# EAGLE design PANS (EAGLE 9.6.2)
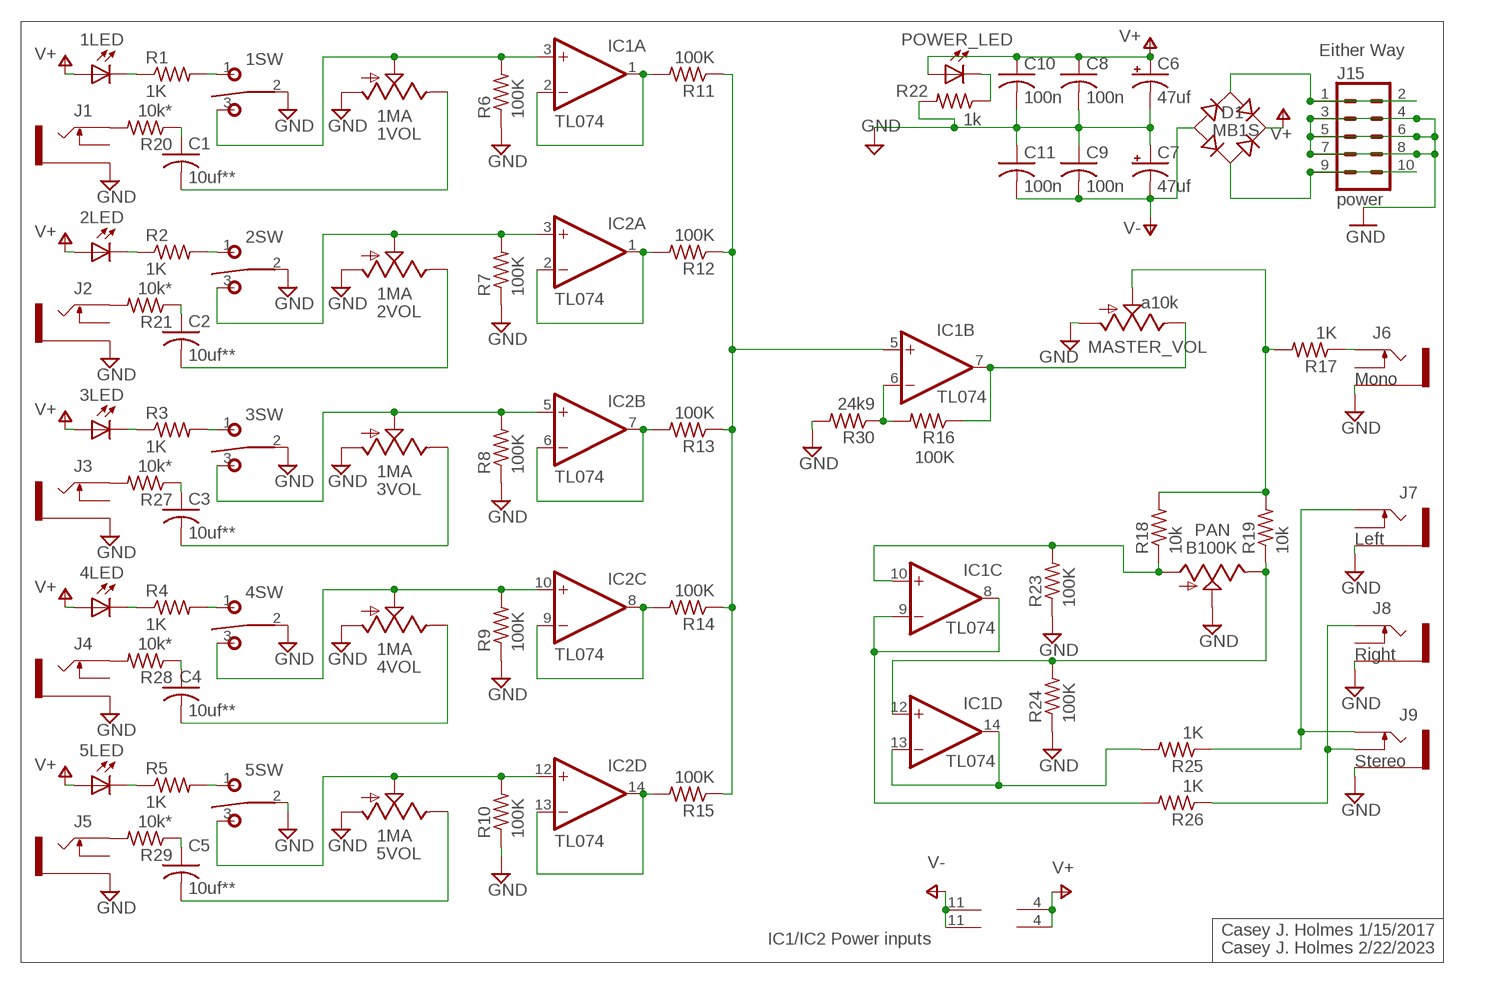
[diagram p0: schematic, sheet 1]

## Parts
1LED  green  LED5MM  [LED5MM]
1SW  on/on  T-80-T-SPDT-ON-OFF-ON  [M9040P]
1VOL  1MA  9MM_SNAP-IN_POT_  [9MM_SNAP-IN_POT]
2LED  green  LED5MM  [LED5MM]
2SW  on/on  T-80-T-SPDT-ON-OFF-ON  [M9040P]
2VOL  1MA  9MM_SNAP-IN_POT_  [9MM_SNAP-IN_POT]
3LED  green  LED5MM  [LED5MM]
3SW  on/on  T-80-T-SPDT-ON-OFF-ON  [M9040P]
3VOL  1MA  9MM_SNAP-IN_POT_  [9MM_SNAP-IN_POT]
4LED  green  LED5MM  [LED5MM]
4SW  on/on  T-80-T-SPDT-ON-OFF-ON  [M9040P]
4VOL  1MA  9MM_SNAP-IN_POT_  [9MM_SNAP-IN_POT]
5LED  green  LED5MM  [LED5MM]
5SW  on/on  T-80-T-SPDT-ON-OFF-ON  [M9040P]
5VOL  1MA  9MM_SNAP-IN_POT_  [9MM_SNAP-IN_POT]
C1  10uf**  C-USC0805K  [C0805K]
C2  10uf**  C-USC0805K  [C0805K]
C3  10uf**  C-USC0805K  [C0805K]
C4  10uf**  C-USC0805K  [C0805K]
C5  10uf**  C-USC0805K  [C0805K]
C6  47uf  CPOL-USD  [PANASONIC_D]
C7  47uf  CPOL-USD  [PANASONIC_D]
C8  100n  C-USC0805  [C0805]
C9  100n  C-USC0805  [C0805]
C10  100n  C-USC0805  [C0805]
C11  100n  C-USC0805  [C0805]
D1  MB1S  [SOIC-4]
IC1  TL074  TL074_SMD  [SO14]
IC2  TL074  TL074_SMD  [SO14]
J1  THONKICONNNEW  [WQP-PJ301M-12_JACK]
J2  THONKICONNNEW  [WQP-PJ301M-12_JACK]
J3  THONKICONNNEW  [WQP-PJ301M-12_JACK]
J4  THONKICONNNEW  [WQP-PJ301M-12_JACK]
J5  THONKICONNNEW  [WQP-PJ301M-12_JACK]
J6  THONKICONNNEW  [WQP-PJ301M-12_JACK]
J7  LEFT  THONKICONNNEW  [WQP-PJ301M-12_JACK]
J8  THONKICONNNEW  [WQP-PJ301M-12_JACK]
J9  Stereo  THONKICONNNEW  [WQP-PJ301M-12_JACK]
J15  power  CONN_05X2PTH  [2X5]
MASTER_VOL  a10k  9MM_SNAP-IN_POT_  [9MM_SNAP-IN_POT]
PAN  B100K  9MM_SNAP-IN_POT_  [9MM_SNAP-IN_POT]
POWER_LED  green  LED5MM  [LED5MM]
R1  1K  R-US_M0805  [M0805]
R2  1K  R-US_M0805  [M0805]
R3  1K  R-US_M0805  [M0805]
R4  1K  R-US_M0805  [M0805]
R5  1K  R-US_M0805  [M0805]
R6  100K  R-US_M0805  [M0805]
R7  100K  R-US_M0805  [M0805]
R8  100K  R-US_M0805  [M0805]
R9  100K  R-US_M0805  [M0805]
R10  100K  R-US_M0805  [M0805]
R11  100K  R-US_M0805  [M0805]
R12  100K  R-US_M0805  [M0805]
R13  100K  R-US_M0805  [M0805]
R14  100K  R-US_M0805  [M0805]
R15  100K  R-US_M0805  [M0805]
R16  100K  R-US_M0805  [M0805]
R17  1K  R-US_M0805  [M0805]
R18  10k  R-US_M0805  [M0805]
R19  10k  R-US_M0805  [M0805]
R20  10k*  R-US_M0805  [M0805]
R21  10k*  R-US_M0805  [M0805]
R22  1k  R-US_M0805  [M0805]
R23  100K  R-US_M0805  [M0805]
R24  100K  R-US_M0805  [M0805]
R25  1K  R-US_M0805  [M0805]
R26  1K  R-US_M0805  [M0805]
R27  10k*  R-US_M0805  [M0805]
R28  10k*  R-US_M0805  [M0805]
R29  10k*  R-US_M0805  [M0805]
R30  24k9  R-US_M0805  [M0805]

## Nets
C2: J2.P$1_TIP(TIP) R21.2
GND: 1SW.2(P) 1VOL.1(A) 2SW.2(P) 2VOL.1(A) 3SW.2(P) 3VOL.1(A) 4SW.2(P) 4VOL.1(A) 5SW.2(P) 5VOL.1(A) C6.- C7.+ C8.2 C9.1 C10.2 C11.1 J1.P$3_SLEEVE(SLEEVE) J2.P$3_SLEEVE(SLEEVE) J3.P$3_SLEEVE(SLEEVE) J4.P$3_SLEEVE(SLEEVE) J5.P$3_SLEEVE(SLEEVE) J6.P$3_SLEEVE(SLEEVE) J7.P$3_SLEEVE(SLEEVE) J8.P$3_SLEEVE(SLEEVE) J9.P$3_SLEEVE(SLEEVE) J15.3 J15.4 J15.5 J15.6 J15.7 J15.8 MASTER_VOL.1(A) PAN.2(S) R6.1 R7.1 R8.1 R9.1 R10.1 R22.2 R23.1 R24.1 R30.2
IC1: IC1.1(A:OUT) IC1.2(A:-IN) R11.2
N$1: J7.P$1_TIP(TIP) J9.P$1_TIP(TIP) R25.1
N$2: J1.P$1_TIP(TIP) R20.2
N$3: 1SW.1(O) R1.2
N$4: 1LED.K(C) R1.1
N$5: 1VOL.3(E) C1.2
N$6: 2SW.1(O) R2.2
N$7: 2LED.K(C) R2.1
N$8: 4LED.K(C) R4.1
N$9: 1SW.3(S) 1VOL.2(S) IC1.3(A:+IN) R6.2
N$10: 5LED.K(C) R5.1
N$11: 3LED.K(C) R3.1
N$12: 5SW.1(O) R5.2
N$13: J4.P$1_TIP(TIP) R28.2
N$14: 3SW.1(O) R3.2
N$15: 4SW.1(O) R4.2
N$16: J5.P$1_TIP(TIP) R29.2
N$17: IC1.6(B:-IN) R16.2 R30.1
N$18: 2VOL.3(E) C2.2
N$19: 3VOL.3(E) C3.2
N$20: 4VOL.3(E) C4.2
N$21: 5VOL.3(E) C5.2
N$22: 2SW.3(S) 2VOL.2(S) IC2.3(A:+IN) R7.2
N$23: 3SW.3(S) 3VOL.2(S) IC2.5(B:+IN) R8.2
N$24: 4SW.3(S) 4VOL.2(S) IC2.10(C:+IN) R9.2
N$25: 5SW.3(S) 5VOL.2(S) IC2.12(D:+IN) R10.2
N$26: J8.P$1_TIP(TIP) J9.P$2_SWITCH(SWITCH) R26.1
N$27: IC2.1(A:OUT) IC2.2(A:-IN) R12.2
N$28: IC2.6(B:-IN) IC2.7(B:OUT) R13.2
N$29: IC2.8(C:OUT) IC2.9(C:-IN) R14.2
N$30: IC2.13(D:-IN) IC2.14(D:OUT) R15.2
N$31: IC1.5(B:+IN) R11.1 R12.1 R13.1 R14.1 R15.1
N$32: POWER_LED.K(C) R22.1
N$33: MASTER_VOL.2(S) R17.2 R18.2 R19.2
N$34: J6.P$1_TIP(TIP) R17.1
N$35: C1.1 R20.1
N$36: IC1.12(D:+IN) PAN.3(E) R19.1 R24.2
N$37: C4.1 R28.1
N$38: IC1.10(C:+IN) PAN.1(A) R18.1 R23.2
N$39: IC1.8(C:OUT) IC1.9(C:-IN) R26.2
N$40: IC1.13(D:-IN) IC1.14(D:OUT) R25.2
N$41: IC1.7(B:OUT) MASTER_VOL.3(E) R16.1
N$42: C5.1 R29.1
N$43: C2.1 R21.1
N$44: C3.1 R27.1
N$45: J3.P$1_TIP(TIP) R27.2
N$47: D1.~2(AC2) J15.9 J15.10
SV1: D1.~1(AC1) J15.1 J15.2
V+: 1LED.A 2LED.A 3LED.A 4LED.A 5LED.A C6.+ C8.1 C10.1 D1.+ IC1.4(P:V+) IC2.4(P:V+) POWER_LED.A
V-: C7.- C9.2 C11.2 D1.- IC1.11(P:V-) IC2.11(P:V-)
Unconnected: J1.P$2_SWITCH(SWITCH) J2.P$2_SWITCH(SWITCH) J3.P$2_SWITCH(SWITCH) J4.P$2_SWITCH(SWITCH) J5.P$2_SWITCH(SWITCH) J6.P$2_SWITCH(SWITCH) J7.P$2_SWITCH(SWITCH) J8.P$2_SWITCH(SWITCH)

## Notes on the sheet
- Either Way
- Mono
- Left
- Right
- Stereo
- Casey J. Holmes 1/15/2017
- IC1/IC2 Power inputs
- Casey J. Holmes 2/22/2023

## Library data of the parts
1LED 2LED 3LED 4LED 5LED POWER_LED = adafruit:LED: LED OSRAM: - CHIPLED LG R971, LG N971, LY N971, LG Q971, LY Q971, LO R971, LY R971 LH N974, LH R974 LS Q976, LO Q976, LY Q976 LO Q996 - Hyper CHIPLED LW Q18S LB Q993, LB Q99A, LB R99A - SideLED LS A670, LO A670, LY A670, LG A670, LP A670 LB A673, LV A673, LT A673, LW A673 LH A674 LY A675 LS A676, LA A676, LO A676, LY A676, LW A676 LS A679, LY A679, LG A679 - Hyper Micro SIDELED® LS Y876, LA Y876, LO Y876, LY Y876 LT Y87S - SmartLED LW L88C, LW L88S LB L89C, LB L89S, LG L890 LS L89K, LO L89K, LY L89K LS L896, LA L896, LO L896, LY L896 - TOPLED LS T670, LO T670, LY T670, LG T670, LP T670 LSG T670, LSP T670, LSY T670, LOP T670, LYG T670 LG T671, LOG T671, LSG T671 LB T673, LV T673, LT T673, LW T673 LH T674 LS T676, LA T676, LO T676, LY T676, LB T676, LH T676, LSB T676, LW T676 LB T67C, LV T67C, LT T67C, LS T67K, LO T67K, LY T67K, LW E67C LS E67B, LA E67B, LO E67B, LY E67B, LB E67C, LV E67C, LT E67C LW T67C LS T679, LY T679, LG T679 LS T770, LO T770, LY T770, LG T770, LP T770 LB T773, LV T773, LT T773, LW T773 LH T774 LS E675, LA E675, LY E675, LS T675 LS T776, LA T776, LO T776, LY T776, LB T776 LHGB T686 LT T68C, LB T68C - Hyper Mini TOPLED® LB M676 - Mini TOPLED Santana® LG M470 LS M47K, LO M47K, LY M47K Source: http://www.osram.convergy.de/
1SW 2SW 3SW 4SW 5SW = MusicThingModular:T-80-T-SPDT-ON-OFF-ON
1VOL 2VOL 3VOL 4VOL 5VOL MASTER_VOL PAN = MusicThingModular:9MM_SNAP-IN_POT: 9mm vertical snap-in pot, Alpha / Panasonic style
C1-C5 = rcl:C-US: CAPACITOR, American symbol; SPICEPREFIX: C
C6 C7 = rcl:CPOL-US: POLARIZED CAPACITOR, American symbol; SPICEPREFIX: C
C8-C11 = resistor:C-US: CAPACITOR, American symbol
D1 = rectifier:MB*S: Bridge Rectifier Source: http://www.fairchildsemi.com/ds/MB/MB6S.pdf
IC1 IC2 = MusicThingModular:TL074: Generic Quad Op Amp
J1-J9 = MusicThingModular:THONKICONN: 3.5mm socket for Eurorack modular synths
J15 = SparkFun-Connectors:CONN_05X2: Multi connection point. Often used as Generic Header-pin footprint for 0.1 inch spaced/style header connections For AVR SPI programming port, see special device with nice symbol: "AVR_SPI_PROG_5x2.dev" You can populate with any combo of single row headers, but if you'd like an exact match, check these: 2x5 AVR ICSP Male Header <https://www.sparkfun.com/products/778> (PRT-00778) 2x5 Pin Shrouded Header <https://www.sparkfun.com/products/8506> (PRT-08506) On any of the 0.1 inch spaced packages, you can populate with these: Break Away Headers - Straight <https://www.sparkfun.com/products/116> (PRT-00116) Break Away Male Headers - Right Angle <https://www.sparkfun.com/products/553> (PRT-00553) Female Headers <https://www.sparkfun.com/products/115> (PRT-00115) Break Away Headers - Machine Pin <https://www.sparkfun.com/products/117> (PRT-00117) Break Away Female Headers - Swiss Machine Pin <https://www.sparkfun.com/products/743> (PRT-00743) Special note: the shrouded connector mates well with our 5x2 ribbon cables: 2x5 Pin IDC Ribbon Cable <https://www.sparkfun.com/products/8535> (PRT-08535); PROD_ID: CONN-08499; SF_ID: PRT-0778
R1-R30 = resistor:R-US_: RESISTOR, American symbol

## Board
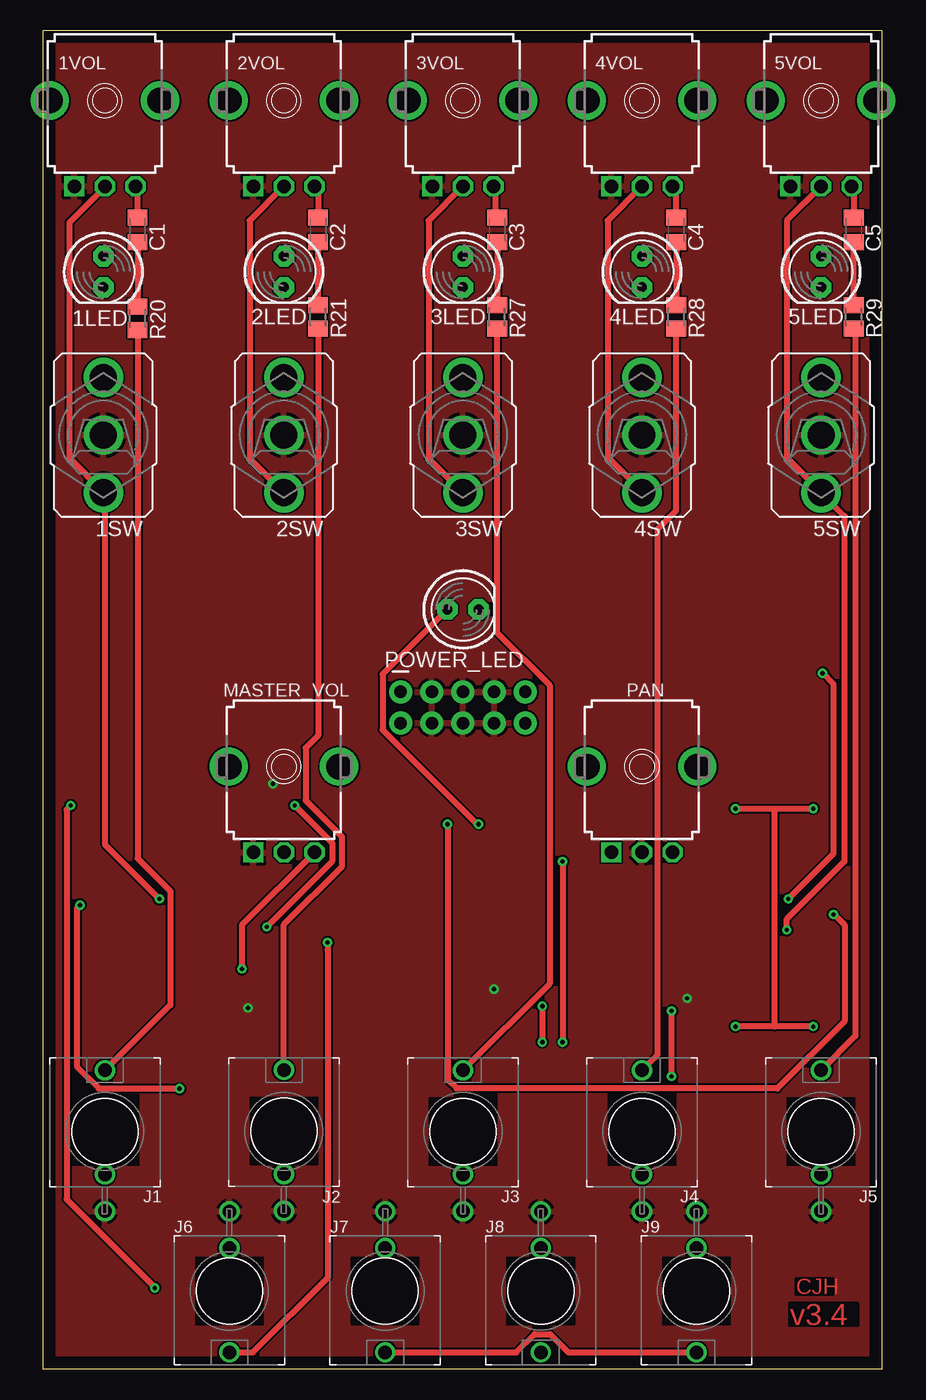
[diagram p1: board, top side]
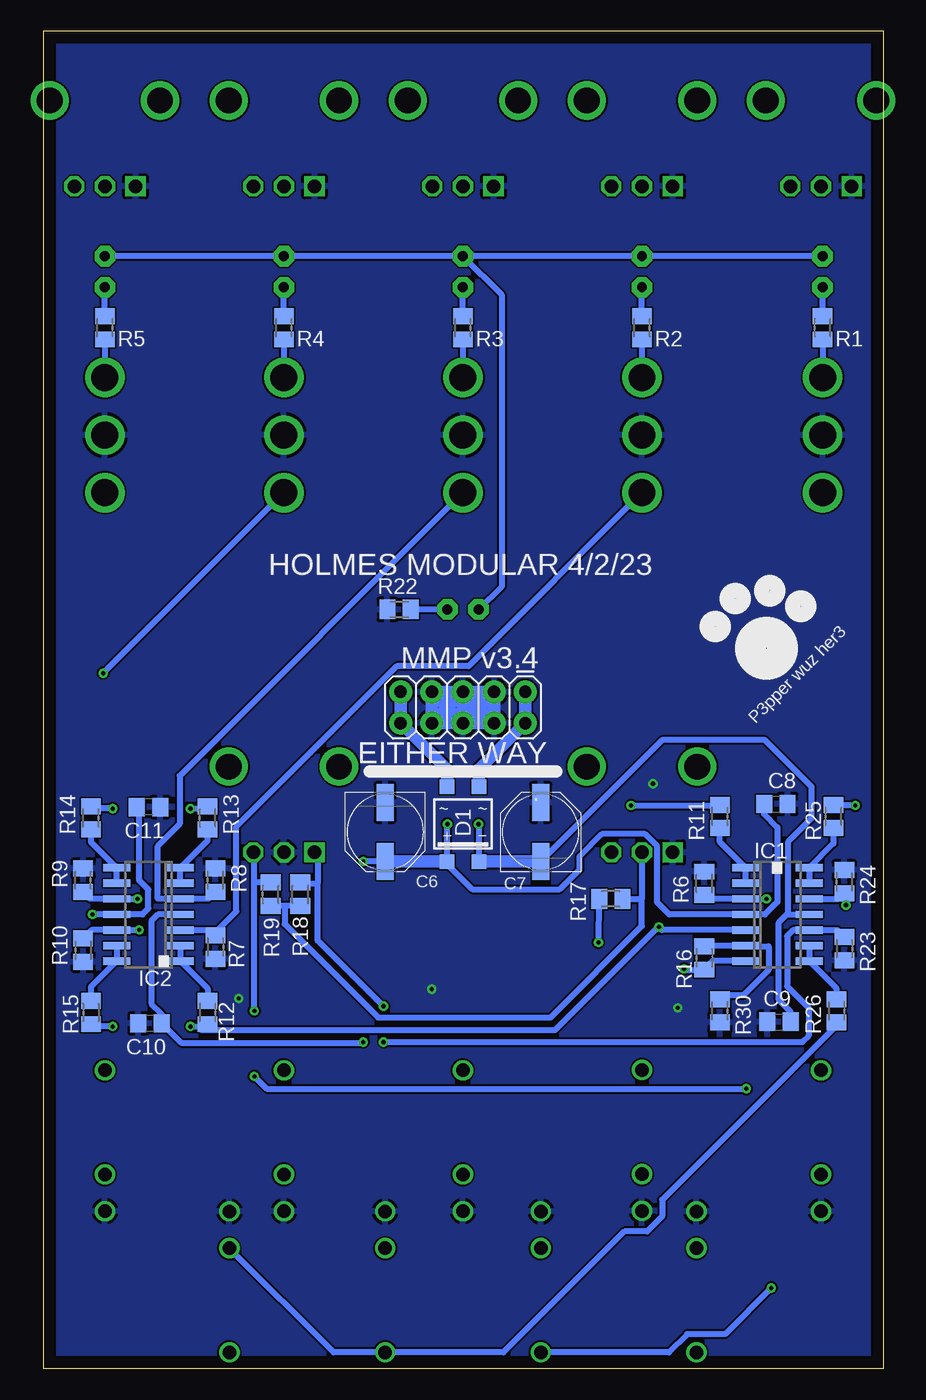
[diagram p2: board, bottom side, seen from below]

Size 68.5 x 109.21 mm. Coordinates in mm from the lower left corner, seen from the top.
Outline: 0,0 68.5,0 68.5,109.21 0,109.21 0,0
Copper layers (1*16): Top 0.035mm / dielectric 1.5mm / Bottom 0.035mm
Design rules "default": minimum track width 6mil, minimum drill 0.35mm, track to track 6mil, track to pad 6mil, pad to pad 6mil, via to via 6mil, smd to smd 6mil, copper to edge 40mil, drill to drill 6mil, minimum pad ring 10mil, minimum via ring 8mil, stop-mask expansion 4mil, vias tented up to drill 0mil, thermal gap 10mil

### Footprints (pad centres in the part's own frame; a part is rotated, then mirrored left to right if it is on the bottom)
LED5MM = drill 0.813 pad 1.676 octagon: A -1.27,0; K 1.27,0
M9040P = drill 2.2: 1 0,4.699 | drill 2.2 pad 3: 2 0,0; 3 0,-4.699
9MM_SNAP-IN_POT = drill 1.1 square: 1 -2.5,-7 | drill 1.1 octagon: 2 0,-7; 3 2.5,-7 | drill 2.1 pad 2.794: CHASSIS1 -4.5,0; CHASSIS2 4.5,0
C0805K = smd 1.3 x 1.6: 1 -1,0; 2 1,0
PANASONIC_D = smd 3 x 1.4: + 2.4,0; - -2.4,0
C0805 = smd 1.3 x 1.5: 1 -0.95,0; 2 0.95,0
SOIC-4 = smd 1.2 x 1.2: + 1.3,3.05; - -1.3,3.05; ~1 -1.3,-3.05; ~2 1.3,-3.05
SO14 = smd 0.6 x 2.2: 1 -3.81,-2.6; 2 -2.54,-2.6; 3 -1.27,-2.6; 4 0,-2.6; 5 1.27,-2.6; 6 2.54,-2.6; 7 3.81,-2.6; 8 3.81,2.6; 9 2.54,2.6; 10 1.27,2.6; 11 0,2.6; 12 -1.27,2.6; 13 -2.54,2.6; 14 -3.81,2.6
WQP-PJ301M-12_JACK = drill 1.1: P$1_TIP 0,5; P$2_SWITCH 0,-3.5; P$3_SLEEVE 0,-6.5
2X5 = drill 1.016 pad 1.88: 1 0,0; 2 0,2.54; 3 2.54,0; 4 2.54,2.54; 5 5.08,0; 6 5.08,2.54; 7 7.62,0; 8 7.62,2.54; 9 10.16,0; 10 10.16,2.54
M0805 = smd 1.3 x 1.6: 1 -0.95,0; 2 0.95,0

### Placement (x,y rotation side)
1LED  4.95,89.53 270 top
1SW  4.95,76.2 0 top
1VOL  5.08,103.5 0 top
2LED  19.68,89.53 270 top
2SW  19.68,76.2 0 top
2VOL  19.68,103.5 0 top
3LED  34.29,89.53 270 top
3SW  34.29,76.2 0 top
3VOL  34.29,103.5 0 top
4LED  48.89,89.53 270 top
4SW  48.89,76.2 0 top
4VOL  48.89,103.5 0 top
5LED  63.5,89.53 270 top
5SW  63.5,76.2 0 top
5VOL  63.5,103.5 0 top
C1  7.75,92.96 90 top
C2  22.48,92.96 90 top
C3  37.08,92.96 90 top
C4  51.69,92.96 90 top
C5  66.17,92.96 90 top
C6  40.64,43.81 270 bottom
C7  27.94,43.81 90 bottom
C8  8.76,46.1 0 bottom
C9  8.51,28.32 0 bottom
C10  59.82,28.19 180 bottom
C11  59.94,45.85 180 bottom
D1  34.29,44.45 180 bottom
IC1  8.64,37.08 270 bottom
IC2  59.94,37.08 90 bottom
J1  5.08,19.37 0 top
J2  19.68,19.39 0 top
J3  34.29,19.37 0 top
J4  48.89,19.37 0 top
J5  63.5,19.37 0 top
J6  15.24,6.35 180 top
J7  27.94,6.35 180 top
J8  40.64,6.35 180 top
J9  53.34,6.35 180 top
J15  29.21,55.24 180 bottom
MASTER_VOL  19.68,49.15 0 top
PAN  48.89,49.15 0 top
POWER_LED  34.29,61.98 0 top
R1  4.95,84.96 270 bottom
R2  19.68,84.96 270 bottom
R3  34.29,84.96 270 bottom
R4  48.89,84.96 270 bottom
R5  63.5,84.96 270 bottom
R6  14.61,39.62 270 bottom
R7  54.48,34.42 90 bottom
R8  54.48,39.88 270 bottom
R9  65.28,39.88 270 bottom
R10  65.28,34.16 90 bottom
R11  13.34,45.09 270 bottom
R12  55.12,29.08 90 bottom
R13  55.12,44.96 270 bottom
R14  64.64,44.96 270 bottom
R15  64.64,29.08 90 bottom
R16  14.61,33.53 90 bottom
R17  22.23,38.35 0 bottom
R18  47.56,38.73 270 bottom
R19  49.97,38.73 270 bottom
R20  7.75,85.72 270 top
R21  22.48,85.85 270 top
R22  39.5,61.98 180 bottom
R23  3.18,34.29 90 bottom
R24  3.18,39.75 270 bottom
R25  4.06,45.09 270 bottom
R26  3.81,29.21 90 bottom
R27  37.08,85.85 270 top
R28  51.69,85.85 270 top
R29  66.17,85.85 270 top
R30  13.34,29.21 270 bottom

### Tracks (layer width: path | path; a pad name or v marks a point on that pad's centre or on a via)
C2
  Top 0.508: J2.P$1_TIP 19.68,36.26 24.43,41 24.43,43.42 21.46,46.39 21.46,50.67 22.48,51.69 22.48,84.64 22.48,84.65 R21.2
GND  (via drill 0.35)
  Bottom 1.016: J15.8 J15.7 | J15.6 J15.5 | J15.4 J15.3 | J15.4 J15.5 | J15.6 J15.7 | J15.8 J15.5 | J15.6 J15.3 | J15.4 J15.6 | J15.7 J15.5 | J15.3 J15.5 | J15.8 J15.6
  other vias: 16.76,29.46 18.8,47.75 36.83,30.99 52.58,30.23
  pour Bottom: 0,0 0,109.22 68.58,109.22 68.58,0
  pour Top: 0,0 0,109.22 68.58,109.22 68.58,0
IC1
  Bottom 0.508: IC1.2 IC1.1 13.34,42.99 R11.2
N$1  (via drill 0.35)
  Top 0.508: v2.29,45.97 1.96,45.65 1.96,13.85 9.14,6.67 v9.14,6.6 | J7.P$1_TIP 38.64,1.35 40.13,2.83 41.4,2.83 42.89,1.35 J9.P$1_TIP
  Bottom 0.508: v2.29,45.97 4,45.97 R25.1 | v9.14,6.6 12.91,2.83 16,2.83 17.49,1.35 J7.P$1_TIP
N$2
  Top 0.508: R20.2 7.75,41.66 10.41,38.99 10.41,29.7 J1.P$1_TIP
N$3
  Bottom 0.508: R1.2 1SW.1
N$4
  Bottom 0.508: R1.1 1LED.K
N$5
  Top 0.508: 1VOL.3 7.71,96.38 7.71,94 C1.2
N$6
  Bottom 0.508: R2.2 2SW.1
N$7
  Bottom 0.508: R2.1 2LED.K
N$8
  Bottom 0.508: R4.1 4LED.K
N$9  (via drill 0.35)
  Top 0.508: 1VOL.2 5.08,96.45 2.18,93.54 2.18,74.35 4.96,71.57 1SW.3 4.96,71.75 5.08,71.63 5.08,42.8 v9.53,38.35
  Bottom 0.508: R6.2 14.29,38.35 IC1.3 v9.53,38.35
N$10
  Bottom 0.508: R5.1 5LED.K
N$11
  Bottom 0.508: R3.1 3LED.K
N$12
  Bottom 0.508: R5.2 5SW.1
N$13
  Top 0.508: J4.P$1_TIP 50.16,25.64 50.16,68.52 51.67,70.03 51.67,84.88 R28.2
N$14
  Bottom 0.508: R3.2 3SW.1
N$15
  Bottom 0.508: R4.2 4SW.1
N$16
  Top 0.508: J5.P$1_TIP 66.29,27.16 66.29,84.78 R29.2
N$17
  Bottom 0.508: R16.2 14.54,34.54 IC1.6 11.18,34.49 9.35,34.49 9.35,32.55 11.37,30.54 12.96,30.54 R30.1
N$18
  Top 0.508: 2VOL.3 22.48,96.21 C2.2
N$19
  Top 0.508: C3.2 36.92,94.13 36.92,96.38 3VOL.3
N$20
  Top 0.508: C4.2 51.69,96.21 4VOL.3
N$21
  Top 0.508: 5VOL.3 66.17,96.34 C5.2
N$22
  Top 0.508: 2VOL.2 16.89,93.71 16.89,74.3 2SW.3
  Bottom 0.508: IC2.3 54.86,35.81 54.48,35.43 R7.2 54.48,35.63 52.77,37.35 52.77,44.26 46.74,50.29 46.73,50.29 39.67,57.35 33.83,57.35 2SW.3
N$23
  Top 0.508: 3VOL.2 31.5,93.71 31.5,74.3 3SW.3
  Bottom 0.508: R8.2 55.06,38.35 IC2.5 59.18,38.35 59.18,42.67 57.4,44.45 57.4,48.39 3SW.3
N$24  (via drill 0.35)
  Top 0.508: 4VOL.2 46.1,93.71 46.1,74.42 48.89,71.63 4SW.3 | v63.63,56.77 64.52,55.88 64.52,42.04 v60.83,38.35
  Bottom 0.508: R9.2 64.7,38.35 IC2.10 v60.83,38.35 | v63.63,56.77 4SW.3
N$25  (via drill 0.35)
  Top 0.508: 5VOL.2 60.72,93.73 60.72,74.35 63.5,71.57 5SW.3 65.41,69.6 65.41,41.4 60.71,36.7 v60.71,35.81
  Bottom 0.508: R10.2 64.58,35.81 IC2.12 v60.71,35.81
N$26
  Bottom 0.508: R26.1 3.81,28.02 18.03,13.8 18.03,12.45 19.26,11.22 21.12,11.22 30.99,1.35 J8.P$1_TIP 44.84,1.35 J9.P$2_SWITCH
N$27
  Bottom 0.508: IC2.2 IC2.1 55.12,31.05 R12.2
N$28
  Bottom 0.508: IC2.6 IC2.7 55.12,43.12 R13.2
N$29
  Bottom 0.508: R14.2 64.64,42.99 IC2.8 IC2.9
N$30
  Bottom 0.508: IC2.13 IC2.14 64.64,31.18 R15.2
N$31  (via drill 0.35)
  Top 0.508: v62.87,27.94 59.69,27.94 | 59.69,27.94 v56.51,27.94 | v56.51,45.72 59.69,45.72 | 59.69,45.72 v62.87,45.72 | 59.69,45.72 59.69,27.94 | v20.57,45.97 23.62,42.93 23.62,41.4 v18.29,36.07
  Bottom 0.508: v56.51,27.94 55.31,27.94 | 55.31,27.94 55.6,27.65 26.77,27.65 18.36,36.07 v18.29,36.07 18.03,35.81 IC1.5 | 55.31,27.94 R12.1 | v62.87,27.94 64.64,27.94 R15.1 | v56.51,45.72 55.31,45.72 R13.1 | v62.87,45.72 64.45,45.72 R14.1 | v20.57,45.97 13.4,45.97 R11.1
N$32
  Bottom 0.508: POWER_LED.K R22.1
N$33
  Bottom 0.508: R18.2 48.83,37.78 | 48.83,37.78 R19.2 | 48.83,37.78 48.83,36.29 41.22,28.68 27.14,28.68 19.68,36.13 19.68,38.35 | MASTER_VOL.2 19.68,38.35 | R17.2 19.68,38.35
N$34  (via drill 0.35)
  Top 0.508: v23.24,34.8 23.24,34.16 23.25,34.16 23.25,7.45 17.15,1.35 J6.P$1_TIP
  Bottom 0.508: v23.24,34.8 23.2,34.77 R17.1
N$35
  Top 0.508: C1.1 R20.1
N$36  (via drill 0.35)
  Top 0.508: v11.18,22.86 11.15,22.88 4.57,22.88 2.79,24.66 2.79,37.59 v3.05,37.85 | v51.31,23.88 v51.31,29.21
  Bottom 0.508: IC1.12 3.62,38.35 R24.2 3.05,38.67 v3.05,37.85 | v11.18,22.86 50.29,22.86 v51.31,23.88 | PAN.3 51.31,42.06 51.31,39.62 | v51.31,29.21 51.31,39.62 | R19.1 51.25,39.69 51.31,39.62
N$37
  Top 0.508: C4.1 R28.1
N$38  (via drill 0.35)
  Top 0.508: v40.77,29.59 v40.77,26.67
  Bottom 0.508: R23.2 3.75,35.81 IC1.10 7.37,35.81 7.85,35.33 7.85,31.22 6.1,29.46 6.1,27.18 6.6,26.67 v40.77,26.67 | v40.77,29.59 46.14,34.96 46.14,39.62 | PAN.1 46.14,41.9 46.14,39.62 | R18.1 47.5,39.62 46.14,39.62
N$39
  Bottom 0.508: R26.2 3.81,31.05 IC1.8 IC1.9
N$40
  Bottom 0.508: R25.2 4.06,42.87 IC1.14 IC1.13
N$41  (via drill 0.35)
  Top 0.508: MASTER_VOL.3 16.26,36.22 v16.26,32.64
  Bottom 0.508: IC1.7 13.91,33.27 R16.1 16.2,32.58 v16.26,32.64
N$42
  Top 0.508: R29.1 C5.1
N$43
  Top 0.508: R21.1 22.45,86.83 22.45,91.94 C2.1
N$44
  Top 0.508: C3.1 R27.1
N$45
  Top 0.508: J3.P$1_TIP 41.35,31.43 41.35,55.8 37.08,60.07 R27.2
N$47
  Bottom 1.016: J15.9 J15.10 35.59,48.92 D1.~2
SV1
  Bottom 1.016: J15.1 J15.2 32.99,48.92 D1.~1
V+  (via drill 0.35)
  Top 0.508: v42.42,41.4 v42.42,26.67 | POWER_LED.A 27.74,56.69 27.74,52.15 35.43,44.45 v35.56,44.45
  Bottom 0.508: IC2.4 59.18,37.08 59.71,36.55 59.71,29.8 58.87,28.96 C10.1 57.29,26.61 42.47,26.61 v42.42,26.67 | C8.1 9.71,45.27 8.64,44.2 8.64,38.1 9.65,37.08 IC1.4 17.45,37.08 18.45,38.09 18.45,42.66 19.43,43.63 22.95,43.63 24.78,41.8 24.78,40.75 26.4,39.13 33.53,39.13 35.81,41.41 C6.+ 42.4,41.41 v42.42,41.4 | D1.+ 35.59,44.42 v35.56,44.45 | 1LED.A 2LED.A 3LED.A | 3LED.A 4LED.A 5LED.A | POWER_LED.A 32.99,61.95 31.13,63.81 31.13,87.65 3LED.A
  Bottom 1.016: C6.+ 35.6,41.41 D1.+
V-  (via drill 0.35)
  Top 0.508: v64.52,37.08 64.56,37.08 65.43,36.22 65.43,28.38 59.93,22.88 33.78,22.88 33.06,23.6 33.06,44.41 v33.02,44.45
  Bottom 0.508: C9.2 7.56,29.15 8.51,30.1 8.51,36.45 7.87,37.08 7.75,37.08 | 7.75,37.08 IC1.11 | 7.75,37.08 7.75,43.05 5.84,44.96 5.84,47.5 9.65,51.31 18.05,51.31 27.96,41.4 | C11.2 60.77,45.85 60.71,45.79 60.71,39.88 59.94,39.12 59.94,37.59 60.45,37.08 IC2.11 v64.52,37.08 | v33.02,44.45 33.02,41.43 D1.-
  Bottom 1.016: D1.- 27.96,41.4 C7.-

### Text on the board
Top: CJH | v3.4
bNames: HOLMES MODULAR 4/2/23 | MMP v3.4 | P3pper wuz her3 | EITHER WAY | . | . | .
tStop: CJH | v3.4
bStop: * | CJH
tRestrict: v3.4